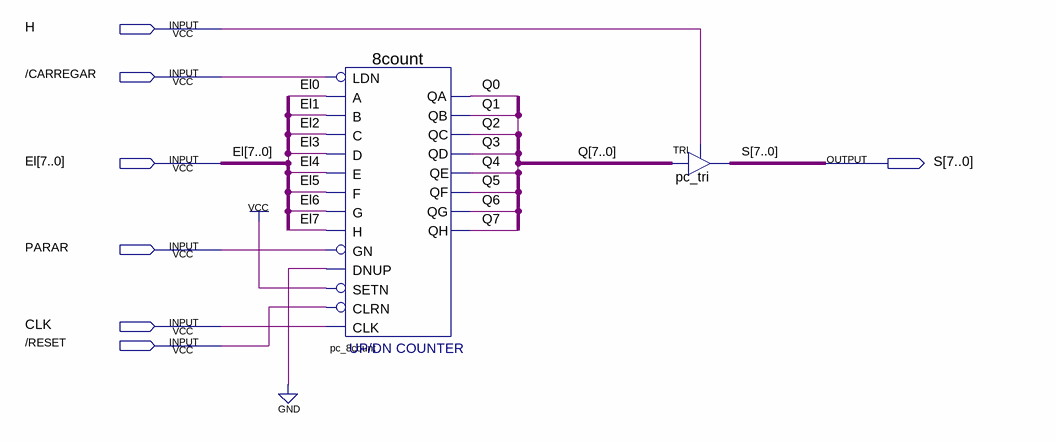
[diagram p0: schematic sheet]
// Quartus schematic ContadorDePrograma.bdf as structural Verilog: 2 symbols, 7 pins
module ContadorDePrograma (
  input  H,
  input  \/CARREGAR ,
  input  [7:0] El,
  input  PARAR,
  input  CLK,
  input  \/RESET ,
  output [7:0] S
);

  wire [7:0] Q;

  \8count  pc_8count (
    .A(El[0]), .B(El[1]), .C(El[2]), .CLK(CLK), .CLRN(\/RESET ), .D(El[3]), .DNUP(1'b0), .E(El[4]),
    .F(El[5]), .G(El[6]), .GN(PARAR), .H(El[7]), .LDN(\/CARREGAR ), .SETN(1'b1), .QA(Q[0]), .QB(Q[1]),
    .QC(Q[2]), .QD(Q[3]), .QE(Q[4]), .QF(Q[5]), .QG(Q[6]), .QH(Q[7]));
  TRI pc_tri[7:0] (.IN(Q), .OE(H), .OUT(S));
endmodule
